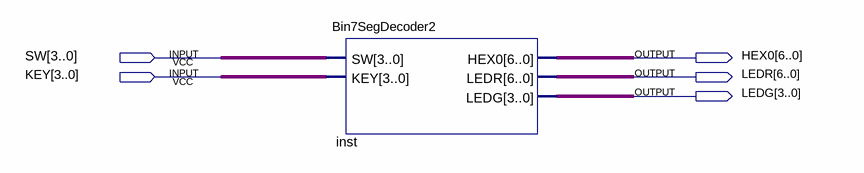
[diagram p0: schematic sheet]
// Quartus schematic DisplayDemo2.bdf as structural Verilog: 1 symbols, 5 pins
module DisplayDemo2 (
  input  [3:0] SW,
  input  [3:0] KEY,
  output [6:0] HEX0,
  output [6:0] LEDR,
  output [3:0] LEDG
);

  Bin7SegDecoder2 inst (.SW(SW), .KEY(KEY), .HEX0(HEX0), .LEDR(LEDR), .LEDG(LEDG));
endmodule
